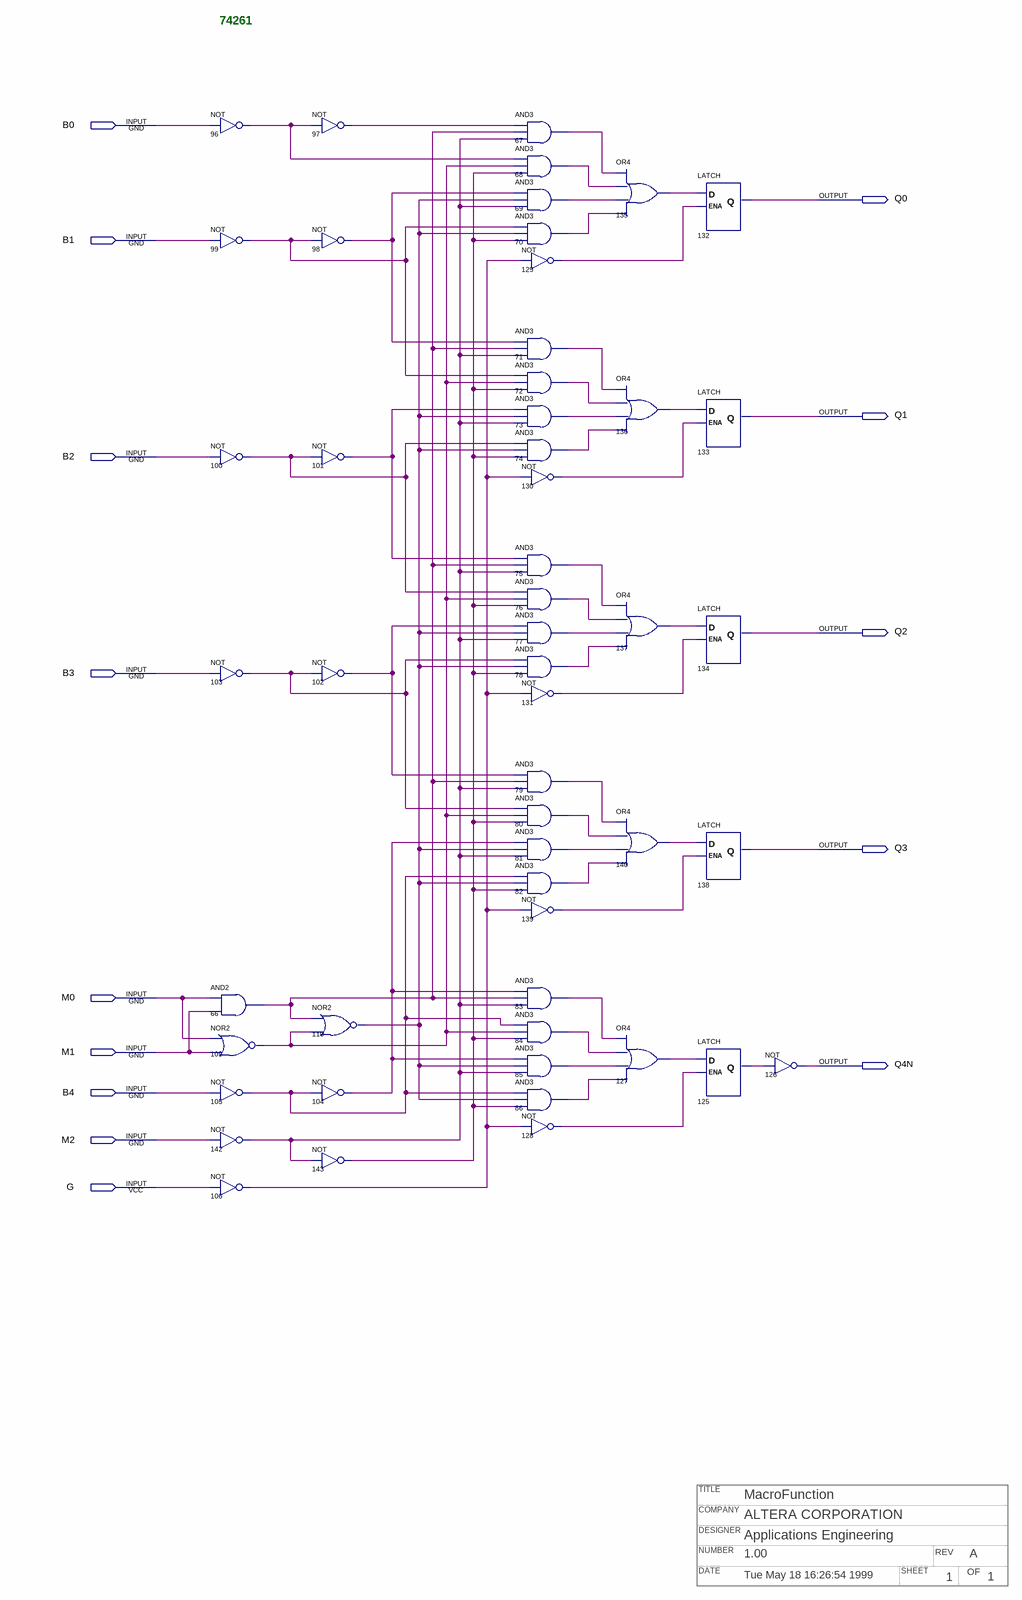
[diagram p0: schematic sheet]
// Quartus schematic 74261.bdf as structural Verilog: 52 symbols, 14 pins
// Title block: TITLE: MacroFunction; COMPANY: ALTERA CORPORATION; DESIGNER: Applications Engineering; NUMBER: 1.00; REV: A; DATE: Tue May 18 16:26:54 1999; SHEET: 1; OF: 1
module \74261  (
  input  B0,
  input  B1,
  input  B2,
  input  B3,
  input  M0,
  input  M1,
  input  B4,
  input  M2,
  input  G,
  output Q0,
  output Q1,
  output Q2,
  output Q3,
  output Q4N
);

  wire n66_out, n67_out, n68_out, n69_out, n70_out, n71_out, n72_out, n73_out, n74_out, n75_out, n76_out,
       n77_out, n78_out, n79_out, n80_out, n81_out, n82_out, n83_out, n84_out, n85_out, n86_out, n96_out,
       n97_out, n98_out, n99_out, n100_out, n101_out, n102_out, n103_out, n104_out, n105_out, n106_out,
       n109_out, n110_out, n125_q, n127_out, n128_out, n129_out, n130_out, n131_out, n135_out, n136_out,
       n137_out, n139_out, n140_out, n142_out, n143_out;

  not u_96 (n96_out, B0);
  not u_99 (n99_out, B1);
  not u_100 (n100_out, B2);
  not u_103 (n103_out, B3);
  and u_66 (n66_out, M0, M1);
  nor u_109 (n109_out, M0, M1);
  not u_105 (n105_out, B4);
  not u_142 (n142_out, M2);
  not u_106 (n106_out, G);
  not u_97 (n97_out, n96_out);
  not u_98 (n98_out, n99_out);
  not u_101 (n101_out, n100_out);
  not u_102 (n102_out, n103_out);
  nor u_110 (n110_out, n66_out, n109_out);
  not u_104 (n104_out, n105_out);
  not u_143 (n143_out, n142_out);
  and u_67 (n67_out, n97_out, n66_out, n142_out);
  and u_68 (n68_out, n96_out, n109_out, n143_out);
  and u_69 (n69_out, n98_out, n110_out, n142_out);
  and u_70 (n70_out, n99_out, n110_out, n143_out);
  not u_129 (n129_out, n106_out);
  and u_71 (n71_out, n98_out, n66_out, n142_out);
  and u_72 (n72_out, n99_out, n109_out, n143_out);
  and u_73 (n73_out, n101_out, n110_out, n142_out);
  and u_74 (n74_out, n100_out, n110_out, n143_out);
  not u_130 (n130_out, n106_out);
  and u_75 (n75_out, n101_out, n66_out, n142_out);
  and u_76 (n76_out, n100_out, n109_out, n143_out);
  and u_77 (n77_out, n102_out, n110_out, n142_out);
  and u_78 (n78_out, n103_out, n110_out, n143_out);
  not u_131 (n131_out, n106_out);
  and u_79 (n79_out, n102_out, n66_out, n142_out);
  and u_80 (n80_out, n103_out, n109_out, n143_out);
  and u_81 (n81_out, n104_out, n110_out, n142_out);
  and u_82 (n82_out, n105_out, n110_out, n143_out);
  not u_139 (n139_out, n106_out);
  and u_83 (n83_out, n104_out, n66_out, n142_out);
  and u_84 (n84_out, n105_out, n109_out, n143_out);
  and u_85 (n85_out, n104_out, n110_out, n142_out);
  and u_86 (n86_out, n105_out, n110_out, n143_out);
  not u_128 (n128_out, n106_out);
  or u_135 (n135_out, n67_out, n68_out, n69_out, n70_out);
  or u_136 (n136_out, n71_out, n72_out, n73_out, n74_out);
  or u_137 (n137_out, n75_out, n76_out, n77_out, n78_out);
  or u_140 (n140_out, n79_out, n80_out, n81_out, n82_out);
  or u_127 (n127_out, n83_out, n84_out, n85_out, n86_out);
  LATCH u_132 (.D(n135_out), .ENA(n129_out), .Q(Q0));
  LATCH u_133 (.D(n136_out), .ENA(n130_out), .Q(Q1));
  LATCH u_134 (.D(n137_out), .ENA(n131_out), .Q(Q2));
  LATCH u_138 (.D(n140_out), .ENA(n139_out), .Q(Q3));
  LATCH u_125 (.D(n127_out), .ENA(n128_out), .Q(n125_q));
  not u_126 (Q4N, n125_q);

  // Notes on the sheet:
  //   74261
endmodule
